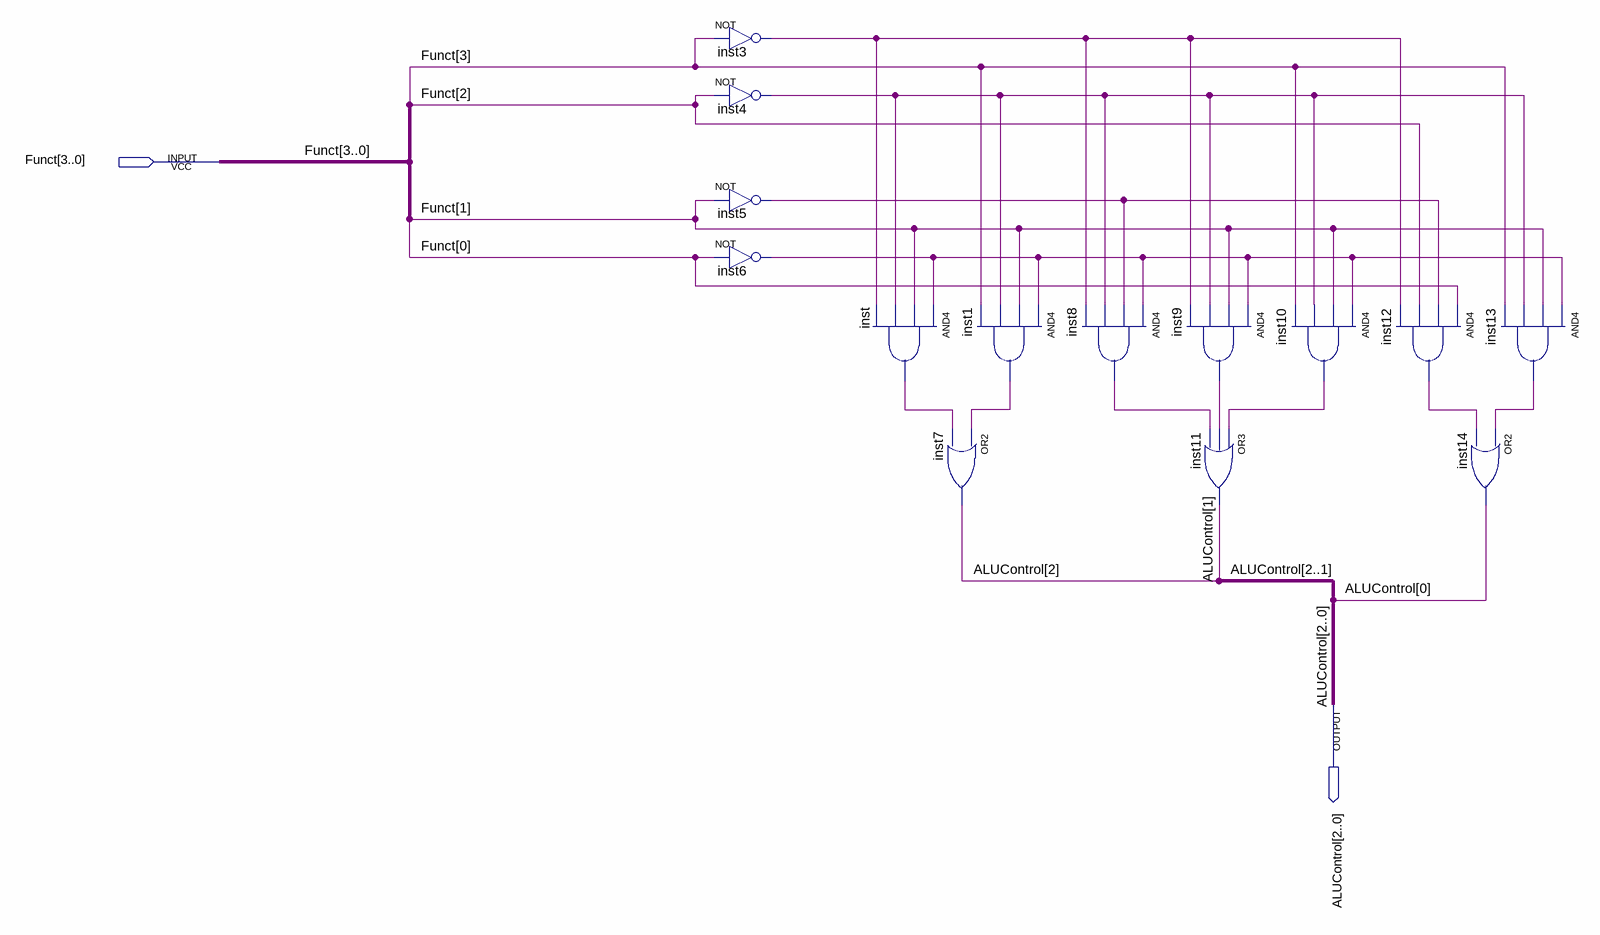
[diagram p0: schematic sheet]
// Quartus schematic aludecoderlogic.bdf as structural Verilog: 14 symbols, 2 pins
module aludecoderlogic (
  input  [3:0] Funct,
  output [2:0] ALUControl
);

  wire inst1_out, inst3_out, inst4_out, inst5_out, inst6_out, inst8_out, inst9_out, inst10_out, inst12_out,
       inst13_out, inst_out;

  not inst3 (inst3_out, Funct[3]);
  not inst4 (inst4_out, Funct[2]);
  not inst5 (inst5_out, Funct[1]);
  not inst6 (inst6_out, Funct[0]);
  and inst (inst_out, inst6_out, Funct[1], inst4_out, inst3_out);
  and inst1 (inst1_out, inst6_out, Funct[1], inst4_out, Funct[3]);
  or inst7 (ALUControl[2], inst1_out, inst_out);
  and inst8 (inst8_out, inst6_out, inst5_out, inst4_out, inst3_out);
  and inst9 (inst9_out, inst6_out, Funct[1], inst4_out, inst3_out);
  or inst11 (ALUControl[1], inst10_out, inst9_out, inst8_out);
  and inst10 (inst10_out, inst6_out, Funct[1], inst4_out, Funct[3]);
  and inst12 (inst12_out, Funct[0], inst5_out, Funct[2], inst3_out);
  and inst13 (inst13_out, inst6_out, Funct[1], inst4_out, Funct[3]);
  or inst14 (ALUControl[0], inst13_out, inst12_out);
endmodule
